# EAGLE design Birthday Card (EAGLE 9.6.2)
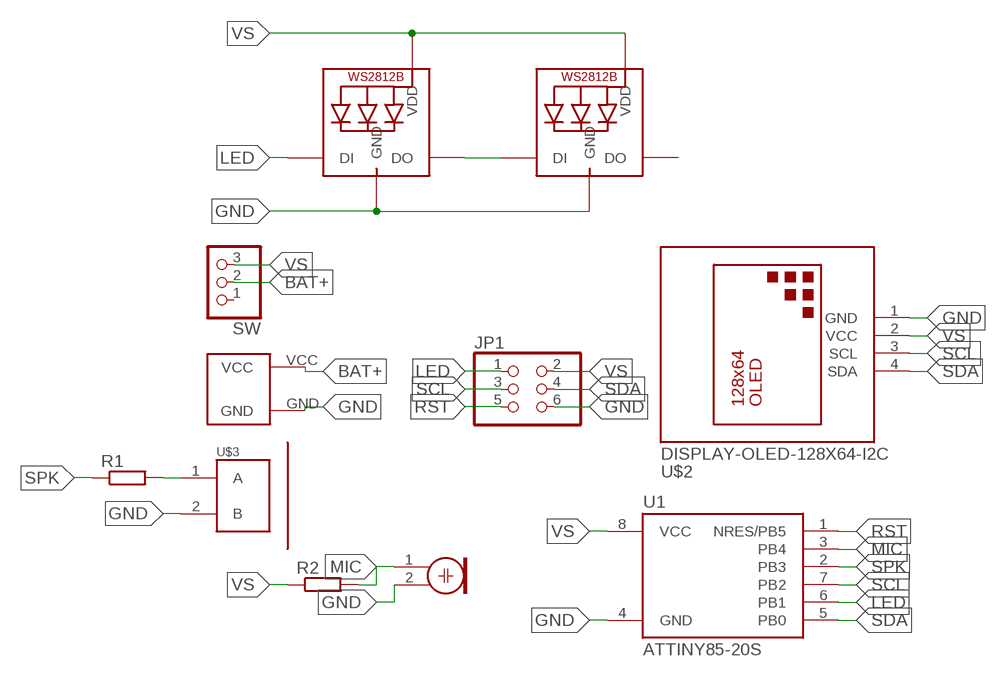
[diagram p0: schematic, sheet 1]

## Parts
JP1  PINHD-2X3  [2X03]
LED1  WS2812B5050  [WS2812B]
LED2  WS2812B5050  [WS2812B]
M1  ELECTRET_MICROPHON-F6050AP  [F6050AP]
R1  R-EU_R1206  [R1206]
R2  R-EU_R1206  [R1206]
SW  PINHD-1X3  [1X03]
U1  ATTINY85-20S  [SOIC8_EIAJ_208MIL]
U$1  CR2032  [CR2032-20MM]
U$2  DISPLAY-OLED-128X64-I2C  [DISPLAY-OLED-128X64-I2C]
U$3  PKLCS1212E2400-R1  [BUZZ_PIEZO_SMD]

## Nets
BAT+: SW.2 U$1.VCC
GND: JP1.6 LED1.3-GND(GND) LED2.3-GND(GND) M1.2 U1.4(GND) U$1.GND U$2.1(GND) U$3.2(B)
LED: JP1.1 LED1.4-DIN(DI) U1.6(PB1)
MIC: M1.1 R2.2 U1.3(PB4)
N$1: LED1.2-DOUT(DO) LED2.4-DIN(DI)
N$4: R1.2 U$3.1(A)
RST: JP1.5 U1.1(NRES/PB5)
SCL: JP1.3 U1.7(PB2) U$2.3(SCL)
SDA: JP1.4 U1.5(PB0) U$2.4(SDA)
SPK: R1.1 U1.2(PB3)
VS: JP1.2 LED1.1-VDD(VDD) LED2.1-VDD(VDD) R2.1 SW.3 U1.8(VCC) U$2.2(VCC)
Unconnected: LED2.2-DOUT(DO) SW.1

## Library data of the parts
JP1 = pinhead:PINHD-2X3: PIN HEADER
LED1 LED2 = adafruit:WS2812B
M1 = microphon:ELECTRET_MICROPHON-: Electret Condenser Microphone
R1 R2 = Clean-Kong:R-EU_: RESISTOR, European symbol
SW = pinhead:PINHD-1X3: PIN HEADER
U1 = attiny25_45_85:ATTINY85*: ATMEL ATtiny 85 Packages: P = PDIP 08 30mil S = SOIC 08 EIAJ 208mil Technologies Note: for complete ordering code (temp. range, finish, tape&reel etc.) see www.atmel.com • Supply Voltage: V = (1.8…5.5)V | [blank] = (2.7…5.5)V • Speed: 10 = 10 MHz | 20 = 20 MHz Author: Dipl.-Ing. FH Rainer Bayer HHN Hochschule Heilbronn (Heilbronn University), rainer.bayer@hs-heilbronn.de Ingenieurbüro ing-rb, mail@ing-rb.de
U$1 = cr2032:CR2032
U$2 = diy-modules:DISPLAY-OLED-128X64-I2C: 128x64 Dot Matrix OLED Module based on SSD1306 chip Variant with I2C interface More details available here: http://www.instructables.com/id/Monochrome-096-i2c-OLED-display-with-arduino-SSD13/ SSD1306 datasheet: https://cdn-shop.adafruit.com/datasheets/SSD1306.pdf Click here to find device on ebay.com <http://www.ebay.com/sch/oled+display+128x64+iic> Note: There are two variants: I2C and SPI. Search for the proper version.
U$3 = piezo-smd:PKLCS1212E2400-R1

## Board
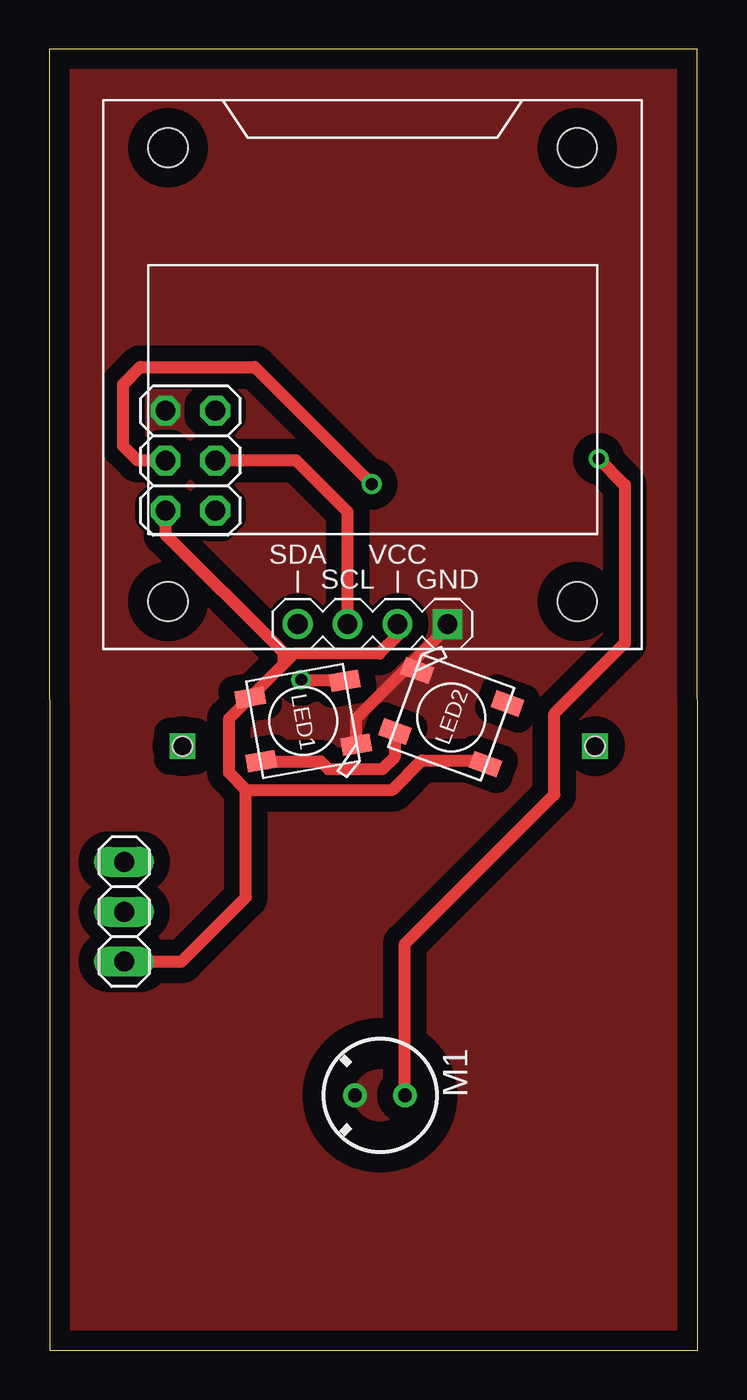
[diagram p1: board, top side]
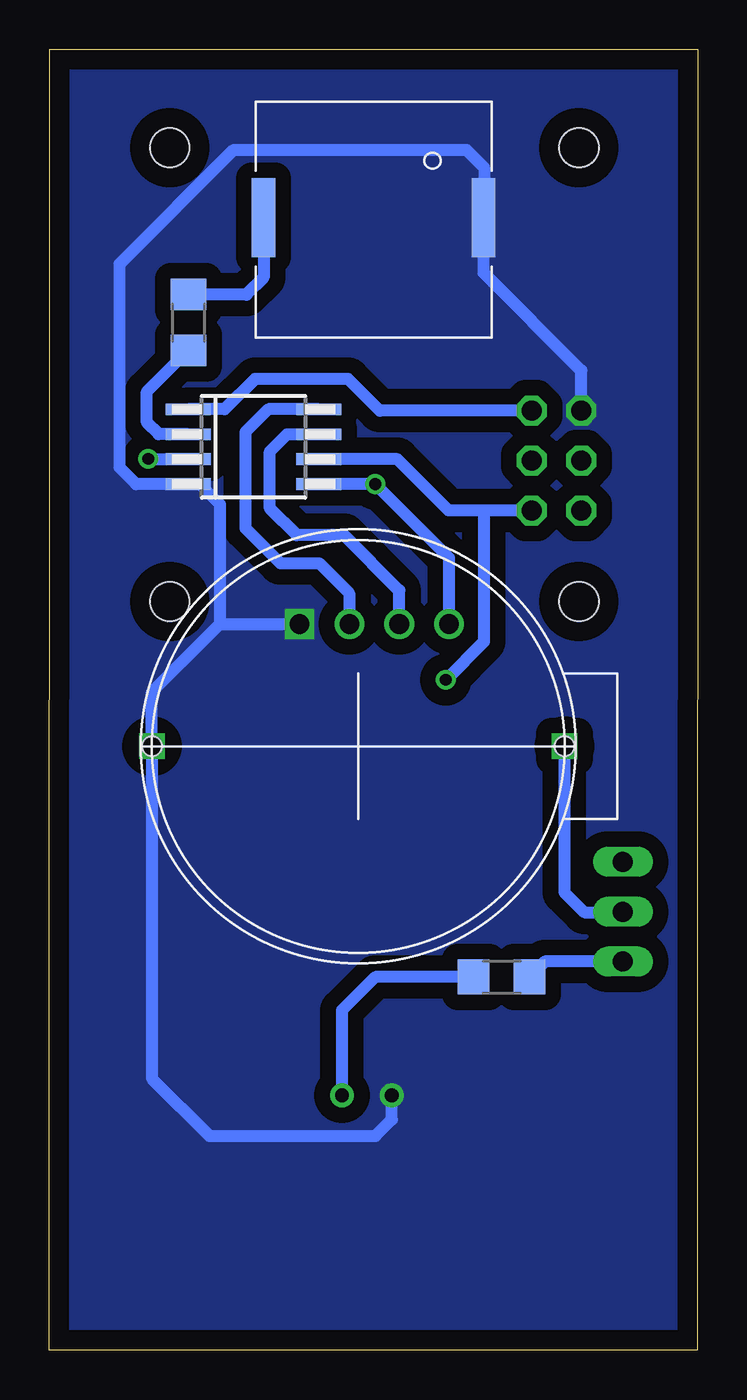
[diagram p2: board, bottom side, seen from below]

Size 33.03 x 66.28 mm. Coordinates in mm from the lower left corner, seen from the top.
Outline: 0.03,0 33.03,0 33,66.28 0,66.28 0.03,0
Copper layers (1*16): Top 0.035mm / dielectric 1.5mm / Bottom 0.035mm
Design rules "default": minimum track width 6mil, minimum drill 0.35mm, track to track 6mil, track to pad 6mil, pad to pad 6mil, via to via 6mil, smd to smd 6mil, copper to edge 40mil, drill to drill 6mil, minimum pad ring 10mil, minimum via ring 8mil, stop-mask expansion 4mil, vias tented up to drill 0mil, thermal gap 10mil

### Footprints (pad centres in the part's own frame; a part is rotated, then mirrored left to right if it is on the bottom)
2X03 = drill 1.016 octagon: 1 -2.54,-1.27; 2 -2.54,1.27; 3 0,-1.27; 4 0,1.27; 5 2.54,-1.27; 6 2.54,1.27
WS2812B = smd 1.5 x 0.9: 1-VDD 2.45,-1.65; 2-DOUT 2.45,1.65; 3-GND -2.45,1.65; 4-DIN -2.45,-1.65
F6050AP = drill 0.7 pad 1.2: 1 0,1.27; 2 0,-1.27
R1206 = smd 1.6 x 1.803: 1 -1.422,0; 2 1.422,0
1X03 = drill 1.016 long: 1 -2.54,0; 2 0,0; 3 2.54,0
SOIC8_EIAJ_208MIL = smd 0.6 x 2.286: 1 -1.905,-3.33; 2 -0.635,-3.33; 3 0.635,-3.33; 4 1.905,-3.33; 5 1.905,3.33; 6 0.635,3.33; 7 -0.635,3.33; 8 -1.905,3.33
CR2032-20MM = drill 0.8 square: GND 0,10.5; VCC 0,-10.5 | hole 1: 0,10.5; 0,-10.5
DISPLAY-OLED-128X64-I2C = drill 1 square: 1 -3.81,12.7 | drill 1: 2 -1.27,12.7; 3 1.27,12.7; 4 3.81,12.7 | hole 2: -10.414,11.557; 10.414,11.557; 10.414,-11.557; -10.414,-11.557
BUZZ_PIEZO_SMD = smd 1.2 x 4: 1 -5.6,0.1; 2 5.6,0.1

### Placement (x,y rotation side)
JP1  7.2,45.32 90 top
LED1  12.93,32.05 190 top
LED2  20.48,32.24 340 top
M1  16.85,12.99 270 top
R1  25.93,52.36 90 bottom
R2  9.99,19.02 180 bottom
SW  3.82,22.34 270 top
U1  22.62,46.03 270 bottom
U$1  17.29,30.77 90 bottom
U$2  16.47,49.7 180 top
U$3  16.5,57.59 0 bottom

### Tracks (layer width: path | path; a pad name or v marks a point on that pad's centre or on a via)
BAT+
  Bottom 0.61: U$1.VCC 6.79,23.33 5.77,22.31 3.82,22.31 SW.2
GND
  Top 0.61: LED1.3-GND 15.63,32.17 18.08,34.62 | 18.08,34.62 LED2.3-GND | U$2.1 20.28,36.82 18.08,34.62
  Bottom 0.61: JP1.6 5.93,49.9 10.9,54.88 U$3.2 10.88,57.72 10.88,60.24 11.78,61.15 23.62,61.15 29.44,55.33 29.44,44.97 28.59,44.12 U1.4 25.36,44.12 24.34,43.1 24.34,37 | 24.34,37 U$2.1 | 24.34,37 27.79,33.54 U$1.GND 27.79,13.86 24.86,10.92 16.42,10.92 15.58,11.76 M1.2
  pour Top (isolate 0.8, no thermals): -0.2,-0.65 -0.2,66.28 33.31,66.28 33.31,-0.65
  pour Bottom (isolate 0.8, no thermals): -0.14,-0.14 33.4,-0.14 33.4,66.18 -0.14,66.18
LED  (via drill 0.6)
  Top 0.61: v12.83,34.16 15.01,34.16 LED1.4-DIN
  Bottom 0.61: JP1.1 10.89,42.78 | 10.89,42.78 12.69,42.78 15.3,45.39 U1.6 | 10.89,42.78 10.89,36.09 v12.83,34.16
MIC  (via drill 0.6)
  Top 0.61: M1.1 18.12,20.7 25.72,28.31 25.72,32.43 29.31,36.02 29.31,44.08 v27.98,45.41
  Bottom 0.61: v27.98,45.41 27.96,45.39 U1.3 | R2.2 16.42,19.02 18.12,17.33 M1.1
N$1
  Top 0.61: LED1.2-DOUT 13.82,30 14.22,29.6 16.96,29.6 17.61,30.26 LED2.4-DIN
N$4
  Bottom 0.61: U$3.1 22.11,54.65 22.98,53.77 25.92,53.77 R1.2
RST
  Bottom 0.61: JP1.5 16.19,47.86 17.81,49.48 22.54,49.48 24.09,47.93 U1.1
SCL
  Top 0.61: U$2.3 15.2,42.7 12.58,45.32 JP1.3
  Bottom 0.61: U$2.3 15.2,38.71 18,41.52 20.42,41.52 21.79,42.89 21.79,45.78 20.91,46.66 U1.7
SDA  (via drill 0.6)
  Top 0.61: JP1.4 4.51,45.32 3.76,46.07 3.76,49.2 4.65,50.09 10.47,50.09 v16.42,44.13
  Bottom 0.61: U$2.4 12.66,40.37 v16.42,44.13 19.28,44.13 U1.5
SPK
  Bottom 0.61: U1.2 27.45,46.66 28.05,47.26 28.05,48.82 R1.1
VS
  Top 0.61: U$2.2 17.74,36.42 16.81,35.49 12.47,35.49 12.23,35.25 | 10.02,28.55 9.15,29.43 9.15,32.17 LED1.1-VDD 11.94,34.96 | LED2.1-VDD 22.02,30.05 18.98,30.05 17.49,28.55 10.02,28.55 | 12.23,35.25 11.73,35.75 | 11.73,35.75 5.93,41.55 JP1.2 | JP1.2 | SW.3 6.74,19.8 10.02,23.08 10.02,28.55 | 11.94,34.96 12.23,35.25 | 11.94,34.96 11.94,35.54 11.73,35.75 | 11.73,35.75
  Bottom 0.61: U$2.2 17.75,36.99 17.75,38.56 19.29,40.09 21.26,40.09 23.04,41.87 23.04,46.76 21.87,47.93 U1.8 | SW.3 7.79,19.8 R2.1

### Text on the board
206bmp: Made by : aryak | https://github.com/aryawisnu/Spesyel-Birthday-Card | SCAN HERE | Wuff uuu | For : | Vira Angelina